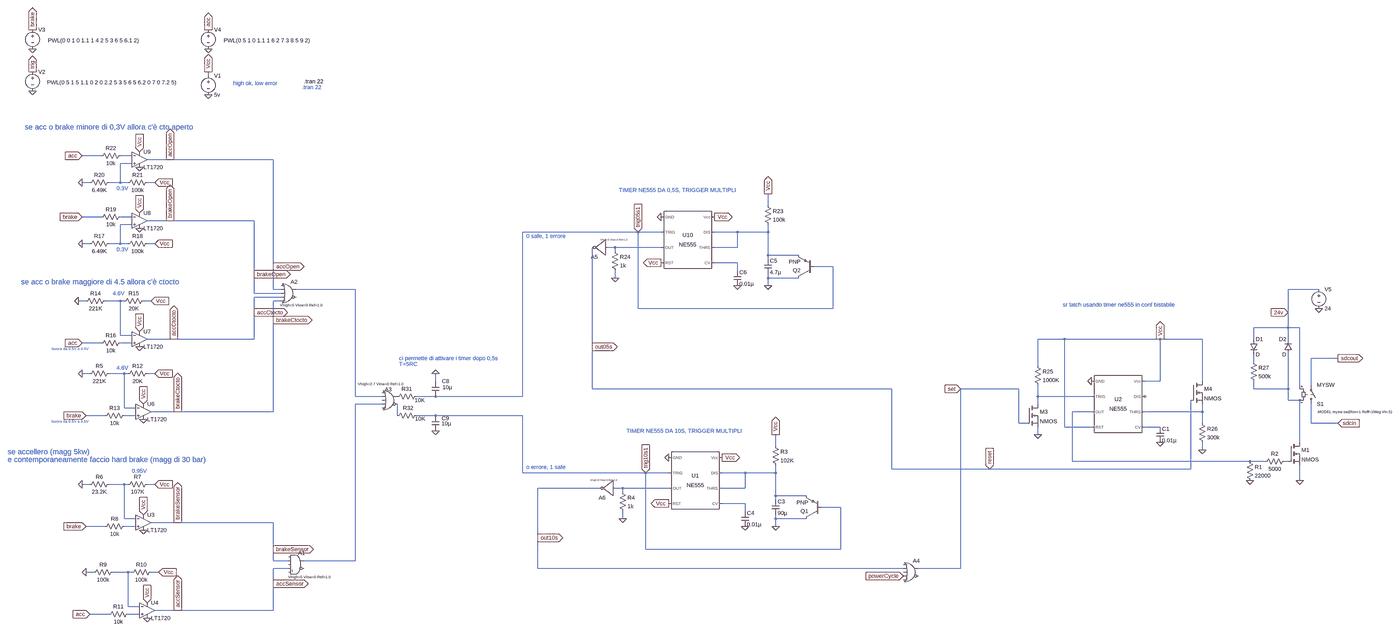
[diagram p0: schematic LTSpice_Bspd_NF.asc, whole sheet]
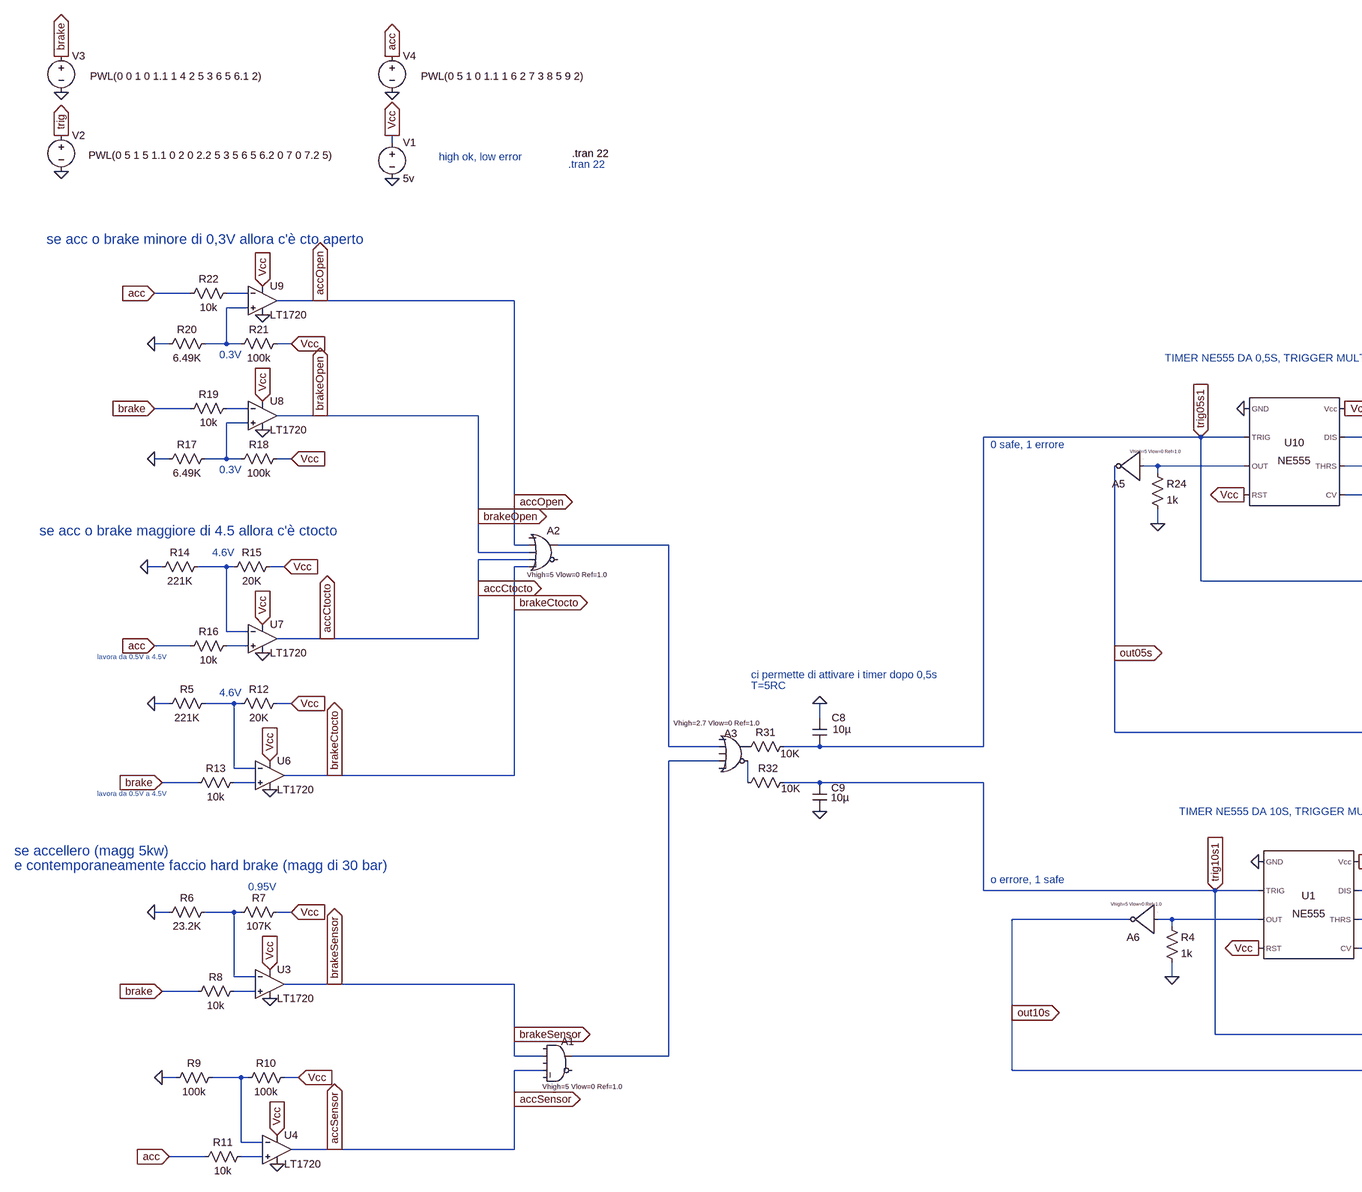
[diagram p1: schematic LTSpice_Bspd_NF.asc, part, row 1 of 1, column 1 of 2]
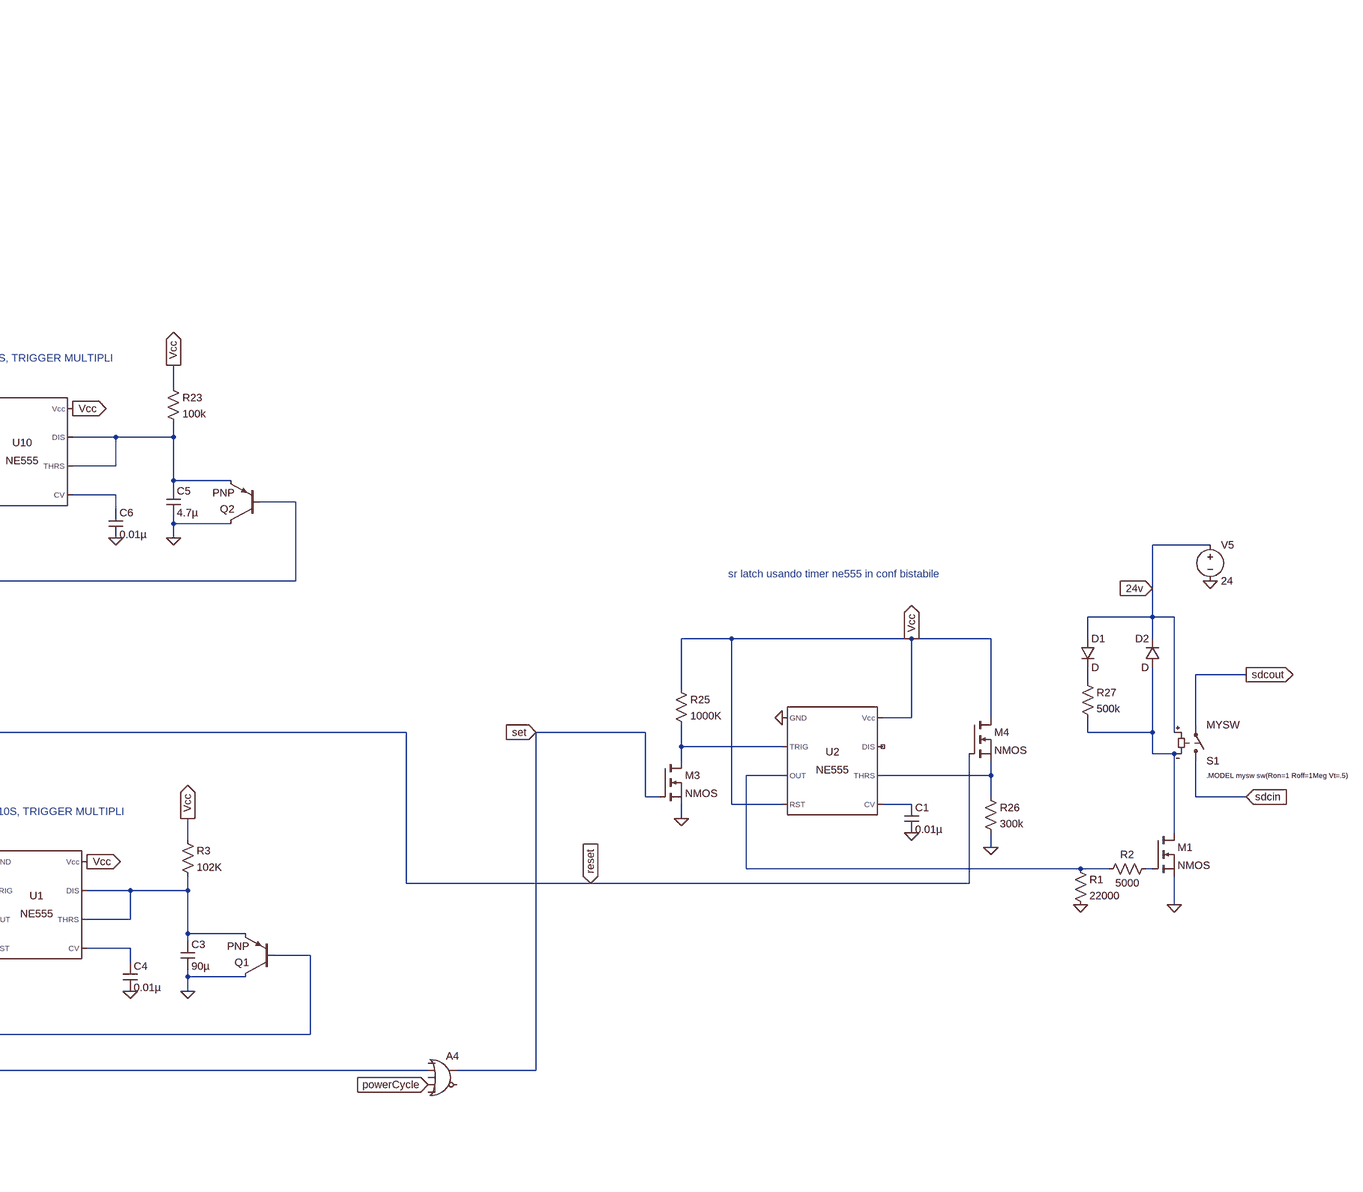
[diagram p2: schematic LTSpice_Bspd_NF.asc, part, row 1 of 1, column 2 of 2]
LTSpice_Bspd_NF.asc, the LTspice schematic file:
Version 4
SHEET 1 5304 2292
WIRE -1056 -720 -1056 -736
WIRE -1504 -368 -1584 -368
WIRE -1376 -368 -1424 -368
WIRE -1216 -352 -1312 -352
WIRE -784 -352 -1216 -352
WIRE -1376 -336 -1424 -336
WIRE -1552 -256 -1584 -256
WIRE -1424 -256 -1424 -336
WIRE -1424 -256 -1472 -256
WIRE -1392 -256 -1424 -256
WIRE -1280 -256 -1312 -256
WIRE 1408 -160 1408 -208
WIRE -1504 -112 -1584 -112
WIRE -1376 -112 -1424 -112
WIRE -1216 -96 -1312 -96
WIRE -864 -96 -1216 -96
WIRE -1376 -80 -1424 -80
WIRE 864 -48 352 -48
WIRE 960 -48 864 -48
WIRE 1280 -48 1184 -48
WIRE 1408 -48 1408 -80
WIRE 1408 -48 1280 -48
WIRE -1552 0 -1584 0
WIRE -1424 0 -1424 -80
WIRE -1424 0 -1472 0
WIRE -1392 0 -1424 0
WIRE -1280 0 -1312 0
WIRE 768 16 736 16
WIRE 960 16 768 16
WIRE 1280 16 1280 -48
WIRE 1280 16 1184 16
WIRE 768 32 768 16
WIRE 1408 48 1408 -48
WIRE 1536 48 1408 48
WIRE 1408 64 1408 48
WIRE 1280 80 1184 80
WIRE -784 96 -784 -352
WIRE 1680 96 1600 96
WIRE 1280 112 1280 80
WIRE -864 128 -864 -96
WIRE 768 144 768 112
WIRE 1408 144 1408 128
WIRE 1536 144 1408 144
WIRE 1408 176 1408 144
WIRE -784 192 -784 96
WIRE -752 192 -784 192
WIRE -368 192 -688 192
WIRE 4528 192 4400 192
WIRE -864 208 -864 128
WIRE -752 208 -864 208
WIRE -752 224 -864 224
WIRE -1568 240 -1600 240
WIRE -1424 240 -1488 240
WIRE -1408 240 -1424 240
WIRE -1296 240 -1328 240
WIRE -752 240 -784 240
WIRE 864 272 864 -48
WIRE 1680 272 1680 96
WIRE 1680 272 864 272
WIRE -864 288 -864 224
WIRE 4400 288 4400 192
WIRE -784 320 -784 240
WIRE 4400 352 4400 288
WIRE 4400 352 4256 352
WIRE 4448 352 4400 352
WIRE -1424 384 -1424 240
WIRE -1376 384 -1424 384
WIRE -1200 400 -1312 400
WIRE -864 400 -864 288
WIRE -864 400 -1200 400
WIRE 3376 400 3264 400
WIRE 3776 400 3376 400
WIRE 3952 400 3776 400
WIRE 4256 400 4256 352
WIRE 4400 400 4400 352
WIRE -1504 416 -1584 416
WIRE -1376 416 -1424 416
WIRE 672 432 672 16
WIRE 4608 480 4496 480
WIRE 4256 496 4256 464
WIRE 3264 512 3264 400
WIRE -1552 544 -1584 544
WIRE -1408 544 -1472 544
WIRE -1392 544 -1408 544
WIRE -1280 544 -1312 544
WIRE -32 576 -32 544
WIRE 3776 576 3776 400
WIRE 3776 576 3712 576
WIRE 3952 576 3952 400
WIRE 4496 592 4496 480
WIRE 672 608 672 432
WIRE 2016 608 672 608
WIRE 3184 608 2304 608
WIRE 4256 608 4256 576
WIRE 4400 608 4400 464
WIRE 4400 608 4256 608
WIRE 4448 608 4448 352
WIRE -368 640 -368 192
WIRE -256 640 -368 640
WIRE -32 640 -112 640
WIRE 352 640 352 -48
WIRE 352 640 -32 640
WIRE 3264 640 3264 592
WIRE 3488 640 3264 640
WIRE 4400 656 4400 608
WIRE 4448 656 4400 656
WIRE -256 672 -368 672
WIRE 3264 672 3264 640
WIRE -1408 688 -1408 544
WIRE -1360 688 -1408 688
WIRE -1184 704 -1296 704
WIRE -784 704 -784 320
WIRE -784 704 -1184 704
WIRE 3488 704 3408 704
WIRE 3952 704 3952 672
WIRE 3952 704 3712 704
WIRE -1488 720 -1568 720
WIRE -1360 720 -1408 720
WIRE -192 720 -192 672
WIRE -32 720 -112 720
WIRE 352 720 -32 720
WIRE 3184 752 3184 608
WIRE 3216 752 3184 752
WIRE 3952 752 3952 704
WIRE 4496 752 4496 672
WIRE 4608 752 4496 752
WIRE 3376 768 3376 400
WIRE 3488 768 3376 768
WIRE 3776 768 3712 768
WIRE 3264 800 3264 768
WIRE 4448 832 4448 656
WIRE 1440 848 1440 800
WIRE 3952 864 3952 832
WIRE 3408 912 3408 704
WIRE 4240 912 3408 912
WIRE 4304 912 4240 912
WIRE 4400 912 4384 912
WIRE 2016 944 2016 608
WIRE 2432 944 2016 944
WIRE 3904 944 3904 656
WIRE 3904 944 2432 944
WIRE 352 960 352 720
WIRE 896 960 352 960
WIRE 992 960 896 960
WIRE 1312 960 1216 960
WIRE 1440 960 1440 928
WIRE 1440 960 1312 960
WIRE 4448 992 4448 928
WIRE -1552 1008 -1584 1008
WIRE -1408 1008 -1472 1008
WIRE -1392 1008 -1408 1008
WIRE -1280 1008 -1312 1008
WIRE 704 1024 416 1024
WIRE 800 1024 768 1024
WIRE 992 1024 800 1024
WIRE 1312 1024 1312 960
WIRE 1312 1024 1216 1024
WIRE 800 1040 800 1024
WIRE 1440 1056 1440 960
WIRE 1568 1056 1440 1056
WIRE 1440 1072 1440 1056
WIRE 1312 1088 1216 1088
WIRE 1712 1104 1632 1104
WIRE 1312 1120 1312 1088
WIRE -1408 1152 -1408 1008
WIRE -1360 1152 -1408 1152
WIRE 800 1152 800 1120
WIRE 1440 1152 1440 1136
WIRE 1568 1152 1440 1152
WIRE -1184 1168 -1296 1168
WIRE -784 1168 -1184 1168
WIRE -1488 1184 -1568 1184
WIRE -1360 1184 -1408 1184
WIRE 1440 1184 1440 1152
WIRE 416 1232 416 1024
WIRE -784 1280 -784 1168
WIRE 896 1280 896 960
WIRE 1712 1280 1712 1104
WIRE 1712 1280 896 1280
WIRE -784 1328 -784 1280
WIRE -720 1328 -784 1328
WIRE -368 1328 -368 672
WIRE -368 1328 -656 1328
WIRE -720 1360 -784 1360
WIRE 416 1360 416 1232
WIRE 2064 1360 416 1360
WIRE 2304 1360 2304 608
WIRE 2304 1360 2128 1360
WIRE -1536 1376 -1568 1376
WIRE -1392 1376 -1456 1376
WIRE -1376 1376 -1392 1376
WIRE -1264 1376 -1296 1376
WIRE -784 1424 -784 1360
WIRE -1392 1520 -1392 1376
WIRE -1344 1520 -1392 1520
WIRE -1184 1536 -1280 1536
WIRE -784 1536 -784 1424
WIRE -784 1536 -1184 1536
WIRE -1472 1552 -1552 1552
WIRE -1344 1552 -1392 1552
FLAG -1056 -640 0
FLAG -1056 -736 Vcc
IOPIN -1056 -736 Out
FLAG -1792 -656 0
FLAG -1792 -736 trig
IOPIN -1792 -736 Out
FLAG 1440 1184 0
FLAG 1440 800 Vcc
IOPIN 1440 800 Out
FLAG 1312 1184 0
FLAG 800 1152 0
FLAG 1216 896 Vcc
IOPIN 1216 896 Out
FLAG 992 896 0
FLAG 992 1088 Vcc
IOPIN 992 1088 Out
FLAG 896 960 trig10s1
IOPIN 896 960 In
FLAG -1568 1184 brake
IOPIN -1568 1184 In
FLAG -1584 1008 0
FLAG -1280 1008 Vcc
IOPIN -1280 1008 In
FLAG -1792 -832 0
FLAG -1792 -912 brake
IOPIN -1792 -912 Out
FLAG -1328 1200 0
FLAG -1328 1136 Vcc
IOPIN -1328 1136 In
FLAG -1552 1552 acc
IOPIN -1552 1552 In
FLAG -1568 1376 0
FLAG -1264 1376 Vcc
IOPIN -1264 1376 In
FLAG -1312 1568 0
FLAG -1312 1504 Vcc
IOPIN -1312 1504 In
FLAG -1056 -832 0
FLAG -1056 -912 acc
IOPIN -1056 -912 Out
FLAG -1568 720 brake
IOPIN -1568 720 In
FLAG -1584 544 0
FLAG -1280 544 Vcc
IOPIN -1280 544 In
FLAG -1328 736 0
FLAG -1328 672 Vcc
IOPIN -1328 672 In
FLAG -1600 240 0
FLAG -1296 240 Vcc
IOPIN -1296 240 In
FLAG -1344 432 0
FLAG -1344 368 Vcc
IOPIN -1344 368 In
FLAG -1584 -368 acc
IOPIN -1584 -368 In
FLAG -1584 -256 0
FLAG -1280 -256 Vcc
IOPIN -1280 -256 In
FLAG -1344 -320 0
FLAG -1344 -384 Vcc
IOPIN -1344 -384 In
FLAG -1584 0 0
FLAG -1280 0 Vcc
IOPIN -1280 0 In
FLAG -1344 -64 0
FLAG -1344 -128 Vcc
IOPIN -1344 -128 In
FLAG -1584 -112 brake
IOPIN -1584 -112 In
FLAG -1216 -352 accOpen
IOPIN -1216 -352 Out
FLAG -1216 -96 brakeOpen
IOPIN -1216 -96 Out
FLAG -1200 400 accCtocto
IOPIN -1200 400 Out
FLAG -1584 416 acc
IOPIN -1584 416 In
FLAG -1184 704 brakeCtocto
IOPIN -1184 704 Out
FLAG -1184 1168 brakeSensor
IOPIN -1184 1168 Out
FLAG -1184 1536 accSensor
IOPIN -1184 1536 Out
FLAG 1408 176 0
FLAG 1408 -208 Vcc
IOPIN 1408 -208 Out
FLAG 1280 176 0
FLAG 768 144 0
FLAG 1184 -112 Vcc
IOPIN 1184 -112 Out
FLAG 960 -112 0
FLAG 960 80 Vcc
IOPIN 960 80 Out
FLAG 864 -48 trig05s1
IOPIN 864 -48 In
FLAG 2064 1392 powerCycle
IOPIN 2064 1392 In
FLAG 672 432 out05s
IOPIN 672 432 Out
FLAG -32 544 0
FLAG -32 784 0
FLAG 2432 944 reset
IOPIN 2432 944 In
FLAG 2304 608 set
IOPIN 2304 608 In
FLAG 3264 800 0
FLAG 3952 864 0
FLAG 3776 400 Vcc
IOPIN 3776 400 Out
FLAG 3488 576 0
FLAG 3776 832 0
FLAG 4240 992 0
FLAG 4448 992 0
FLAG 4400 288 24v
IOPIN 4400 288 In
FLAG 4608 480 sdcout
IOPIN 4608 480 Out
FLAG 4608 752 sdcin
IOPIN 4608 752 In
FLAG 4528 272 0
FLAG 416 1232 out10s
IOPIN 416 1232 Out
FLAG -784 96 accOpen
IOPIN -784 96 Out
FLAG -864 128 brakeOpen
IOPIN -864 128 Out
FLAG -864 288 accCtocto
IOPIN -864 288 Out
FLAG -784 320 brakeCtocto
IOPIN -784 320 Out
FLAG -784 1280 brakeSensor
IOPIN -784 1280 Out
FLAG -784 1424 accSensor
IOPIN -784 1424 Out
SYMBOL voltage -1056 -736 R0
WINDOW 123 0 0 Left 0
WINDOW 39 0 0 Left 0
SYMATTR InstName V1
SYMATTR Value 5v
SYMBOL voltage -1792 -752 R0
WINDOW 3 61 60 Left 2
WINDOW 123 0 0 Left 0
WINDOW 39 0 0 Left 0
SYMATTR Value PWL(0 5 1 5 1.1 0 2 0 2.2 5 3 5 6 5 6.2 0 7 0 7.2 5)
SYMATTR InstName V2
SYMBOL Misc\\NE555 1104 992 R0
SYMATTR InstName U1
SYMBOL res 1424 832 R0
SYMATTR InstName R3
SYMATTR Value 102K
SYMATTR SpiceLine tol=1 pwr=0.1
SYMBOL cap 1424 1072 R0
SYMATTR InstName C3
SYMATTR Value 90µ
SYMATTR SpiceLine V=50 Irms=4.899 Rser=0.025 Lser=0 mfg="Vishay" pn="T54E4906M050" type="Tantalum Polymer"
SYMBOL cap 1296 1120 R0
SYMATTR InstName C4
SYMATTR Value 0.01µ
SYMBOL res 784 1024 R0
SYMATTR InstName R4
SYMATTR Value 1k
SYMBOL pnp 1632 1152 R180
SYMATTR InstName Q1
SYMBOL Comparators\\LT1720 -1328 1104 R0
SYMATTR InstName U3
SYMBOL res -1456 992 R90
WINDOW 0 0 56 VBottom 2
WINDOW 3 32 56 VTop 2
SYMATTR InstName R6
SYMATTR Value 23.2K
SYMATTR SpiceLine tol=1 pwr=0.1
SYMBOL res -1296 992 R90
WINDOW 0 0 56 VBottom 2
WINDOW 3 32 56 VTop 2
SYMATTR InstName R7
SYMATTR Value 107K
SYMATTR SpiceLine tol=1 pwr=0.1
SYMBOL res -1392 1168 R90
WINDOW 0 0 56 VBottom 2
WINDOW 3 32 56 VTop 2
SYMATTR InstName R8
SYMATTR Value 10k
SYMBOL voltage -1792 -928 R0
WINDOW 3 64 61 Left 2
WINDOW 123 0 0 Left 0
WINDOW 39 0 0 Left 0
SYMATTR Value PWL(0 0 1 0 1.1 1 4 2 5 3 6 5 6.1 2)
SYMATTR InstName V3
SYMBOL Comparators\\LT1720 -1312 1472 R0
SYMATTR InstName U4
SYMBOL res -1440 1360 R90
WINDOW 0 0 56 VBottom 2
WINDOW 3 32 56 VTop 2
SYMATTR InstName R9
SYMATTR Value 100k
SYMBOL res -1280 1360 R90
WINDOW 0 0 56 VBottom 2
WINDOW 3 32 56 VTop 2
SYMATTR InstName R10
SYMATTR Value 100k
SYMBOL res -1376 1536 R90
WINDOW 0 0 56 VBottom 2
WINDOW 3 32 56 VTop 2
SYMATTR InstName R11
SYMATTR Value 10k
SYMBOL voltage -1056 -928 R0
WINDOW 3 64 61 Left 2
WINDOW 123 0 0 Left 0
WINDOW 39 0 0 Left 0
SYMATTR Value PWL(0 5 1 0 1.1 1 6 2 7 3 8 5 9 2)
SYMATTR InstName V4
SYMBOL Digital\\or -720 144 R0
WINDOW 39 -36 114 Left 1
SYMATTR SpiceLine Vhigh=5 Vlow=0 Ref=1.0
SYMATTR InstName A2
SYMBOL Comparators\\LT1720 -1328 640 R0
SYMATTR InstName U6
SYMBOL res -1456 528 R90
WINDOW 0 0 56 VBottom 2
WINDOW 3 32 56 VTop 2
SYMATTR InstName R5
SYMATTR Value 221K
SYMATTR SpiceLine tol=1 pwr=0.1
SYMBOL res -1296 528 R90
WINDOW 0 0 56 VBottom 2
WINDOW 3 32 56 VTop 2
SYMATTR InstName R12
SYMATTR Value 20K
SYMATTR SpiceLine tol=1 pwr=0.1
SYMBOL res -1392 704 R90
WINDOW 0 0 56 VBottom 2
WINDOW 3 32 56 VTop 2
SYMATTR InstName R13
SYMATTR Value 10k
SYMBOL Comparators\\LT1720 -1344 336 R0
SYMATTR InstName U7
SYMBOL res -1472 224 R90
WINDOW 0 0 56 VBottom 2
WINDOW 3 32 56 VTop 2
SYMATTR InstName R14
SYMATTR Value 221K
SYMATTR SpiceLine tol=1 pwr=0.1
SYMBOL res -1312 224 R90
WINDOW 0 0 56 VBottom 2
WINDOW 3 32 56 VTop 2
SYMATTR InstName R15
SYMATTR Value 20K
SYMATTR SpiceLine tol=1 pwr=0.1
SYMBOL res -1408 400 R90
WINDOW 0 0 56 VBottom 2
WINDOW 3 32 56 VTop 2
SYMATTR InstName R16
SYMATTR Value 10k
SYMBOL Comparators\\LT1720 -1344 -416 R0
SYMATTR InstName U9
SYMBOL res -1456 -272 R90
WINDOW 0 0 56 VBottom 2
WINDOW 3 32 56 VTop 2
SYMATTR InstName R20
SYMATTR Value 6.49K
SYMATTR SpiceLine tol=1 pwr=0.1
SYMBOL res -1296 -272 R90
WINDOW 0 0 56 VBottom 2
WINDOW 3 32 56 VTop 2
SYMATTR InstName R21
SYMATTR Value 100k
SYMBOL res -1408 -384 R90
WINDOW 0 0 56 VBottom 2
WINDOW 3 32 56 VTop 2
SYMATTR InstName R22
SYMATTR Value 10k
SYMBOL Comparators\\LT1720 -1344 -160 R0
SYMATTR InstName U8
SYMBOL res -1456 -16 R90
WINDOW 0 0 56 VBottom 2
WINDOW 3 32 56 VTop 2
SYMATTR InstName R17
SYMATTR Value 6.49K
SYMATTR SpiceLine tol=1 pwr=0.1
SYMBOL res -1296 -16 R90
WINDOW 0 0 56 VBottom 2
WINDOW 3 32 56 VTop 2
SYMATTR InstName R18
SYMATTR Value 100k
SYMBOL res -1408 -128 R90
WINDOW 0 0 56 VBottom 2
WINDOW 3 32 56 VTop 2
SYMATTR InstName R19
SYMATTR Value 10k
SYMBOL Digital\\or -224 592 R0
WINDOW 39 -133 -4 Left 1
WINDOW 0 -20 19 Left 2
SYMATTR SpiceLine Vhigh=2.7 Vlow=0 Ref=1.0
SYMATTR InstName A3
SYMBOL Digital\\and -688 1280 R0
WINDOW 39 -34 116 Left 1
SYMATTR SpiceLine Vhigh=5 Vlow=0 Ref=1.0
SYMATTR InstName A1
SYMBOL Misc\\NE555 1072 -16 R0
SYMATTR InstName U10
SYMBOL res 1392 -176 R0
SYMATTR InstName R23
SYMATTR Value 100k
SYMATTR SpiceLine tol=1 pwr=0.1
SYMBOL cap 1392 64 R0
SYMATTR InstName C5
SYMATTR Value 4.7µ
SYMATTR SpiceLine V=6.3 Irms=0 Rser=0 Lser=0 mfg="Murata" pn="GRM035R60J475ME15" type="X5R"
SYMBOL cap 1264 112 R0
SYMATTR InstName C6
SYMATTR Value 0.01µ
SYMBOL res 752 16 R0
SYMATTR InstName R24
SYMATTR Value 1k
SYMBOL pnp 1600 144 R180
SYMATTR InstName Q2
SYMBOL Digital\\or 2096 1312 R0
SYMATTR InstName A4
SYMBOL res -96 624 R90
WINDOW 0 0 56 VBottom 2
WINDOW 3 16 2 VTop 2
SYMATTR InstName R31
SYMATTR Value 10K
SYMATTR SpiceLine tol=1 pwr=0.1
SYMBOL cap -48 576 R0
WINDOW 0 43 0 Left 2
WINDOW 3 45 26 Left 2
SYMATTR InstName C8
SYMATTR Value 10µ
SYMATTR SpiceLine V=6.3 Irms=0 Rser=0 Lser=0
SYMBOL cap -48 720 R0
WINDOW 0 42 12 Left 2
WINDOW 3 41 33 Left 2
SYMATTR InstName C9
SYMATTR Value 10µ
SYMATTR SpiceLine V=6.3 Irms=0 Rser=0 Lser=0 mfg="Murata" pn="GRM155R60J106ME47" type="X5R"
SYMBOL res -96 704 R90
WINDOW 0 0 50 VBottom 2
WINDOW 3 14 0 VTop 2
SYMATTR InstName R32
SYMATTR Value 10K
SYMATTR SpiceLine tol=1 pwr=0.1
SYMBOL Digital\\inv 736 80 R180
WINDOW 39 -82 96 Left 0
SYMATTR SpiceLine Vhigh=5 Vlow=0 Ref=1.0
SYMATTR InstName A5
SYMBOL Digital\\inv 768 1088 R180
WINDOW 39 -8 97 Left 0
SYMATTR SpiceLine Vhigh=5 Vlow=0 Ref=1.0
SYMATTR InstName A6
SYMBOL res 3248 496 R0
SYMATTR InstName R25
SYMATTR Value 1000K
SYMATTR SpiceLine tol=1 pwr=0.1
SYMBOL nmos 3216 672 R0
SYMATTR InstName M3
SYMBOL nmos 3904 576 R0
SYMATTR InstName M4
SYMBOL res 3936 736 R0
SYMATTR InstName R26
SYMATTR Value 300k
SYMATTR SpiceLine tol=1 pwr=0.1
SYMBOL Misc\\NE555 3600 672 R0
SYMATTR InstName U2
SYMBOL cap 3760 768 R0
SYMATTR InstName C1
SYMATTR Value 0.01µ
SYMBOL res 4224 896 R0
SYMATTR InstName R1
SYMATTR Value 22000
SYMBOL res 4400 896 R90
WINDOW 0 0 56 VBottom 2
WINDOW 3 32 56 VTop 2
SYMATTR InstName R2
SYMATTR Value 5000
SYMBOL nmos 4400 832 R0
SYMATTR InstName M1
SYMBOL sw 4496 688 M180
SYMATTR InstName S1
SYMATTR Value MYSW
SYMBOL diode 4240 400 R0
SYMATTR InstName D1
SYMBOL diode 4416 464 R180
WINDOW 0 24 64 Left 2
WINDOW 3 24 0 Left 2
SYMATTR InstName D2
SYMBOL res 4240 480 R0
SYMATTR InstName R27
SYMATTR Value 500k
SYMBOL voltage 4528 176 R0
WINDOW 123 0 0 Left 0
WINDOW 39 0 0 Left 0
SYMATTR InstName V5
SYMATTR Value 24
TEXT -664 -672 Left 2 ;.tran 22
TEXT 816 784 Left 2 ;TIMER NE555 DA 10S, TRIGGER MULTIPLI
TEXT -952 -688 Left 2 ;high ok, low error
TEXT -1376 952 Left 2 ;0.95V
TEXT -1712 744 Left 1 ;lavora da 0.5V a 4.5V
TEXT -1712 440 Left 1 ;lavora da 0.5V a 4.5V
TEXT -1824 -488 Left 3 ;se acc o brake minore di 0,3V allora c'è cto aperto
TEXT -1440 -232 Left 2 ;0.3V
TEXT -1440 24 Left 2 ;0.3V
TEXT -1840 160 Left 3 ;se acc o brake maggiore di 4.5 allora c'è ctocto
TEXT -1896 872 Left 3 ;se accellero (magg 5kw)
TEXT -1456 208 Left 2 ;4.6V
TEXT -1440 520 Left 2 ;4.6V
TEXT -656 -696 Left 2 !.tran 22
TEXT 784 -224 Left 2 ;TIMER NE555 DA 0,5S, TRIGGER MULTIPLI
TEXT 3368 256 Left 2 ;sr latch usando timer ne555 in conf bistabile
TEXT -184 480 Left 2 ;ci permette di attivare i timer dopo 0,5s
TEXT -184 504 Left 2 ;T=5RC
TEXT 368 936 Left 2 ;o errore, 1 safe
TEXT 368 -32 Left 2 ;0 safe, 1 errore
TEXT 4520 704 Left 1 !.MODEL mysw sw(Ron=1 Roff=1Meg Vt=.5)
TEXT -1896 904 Left 3 ;e contemporaneamente faccio hard brake (magg di 30 bar)

The netlist it stands for:
* LTSpice_Bspd_NF.asc
V1 Vcc 0 5v
V2 trig 0 PWL(0 5 1 5 1.1 0 2 0 2.2 5 3 5 6 5 6.2 0 7 0 7.2 5)
XU1 0 trig10s1 N024 Vcc N025 N022 N022 Vcc NE555  ; pins GND TRIG OUT RST CV THRS DIS Vcc
R3 Vcc N022 102K tol=1 pwr=0.1
C3 N022 0 90µ V=50 Irms=4.899 Rser=0.025 Lser=0 mfg="Vishay" pn="T54E4906M050" type="Tantalum Polymer"
C4 N025 0 0.01µ
R4 N024 0 1k
Q1 0 trig10s1 N022 0 PNP
XU3 N026 N023 Vcc 0 brakeSensor LT1720  ; pins In+ In- V+ V- OUT
R6 N023 0 23.2K tol=1 pwr=0.1
R7 Vcc N023 107K tol=1 pwr=0.1
R8 N026 brake 10k
V3 brake 0 PWL(0 0 1 0 1.1 1 4 2 5 3 6 5 6.1 2)
XU4 N028 N027 Vcc 0 accSensor LT1720  ; pins In+ In- V+ V- OUT
R9 N027 0 100k
R10 Vcc N027 100k
R11 N028 acc 10k
V4 acc 0 PWL(0 5 1 0 1.1 1 6 2 7 3 8 5 9 2)
A2 0 accOpen brakeOpen accCtocto brakeCtocto 0 N008 0 OR Vhigh=5 Vlow=0 Ref=1.0
XU6 N018 N012 Vcc 0 brakeCtocto LT1720  ; pins In+ In- V+ V- OUT
R5 N012 0 221K tol=1 pwr=0.1
R12 Vcc N012 20K tol=1 pwr=0.1
R13 N018 brake 10k
XU7 N010 N009 Vcc 0 accCtocto LT1720  ; pins In+ In- V+ V- OUT
R14 N009 0 221K tol=1 pwr=0.1
R15 Vcc N009 20K tol=1 pwr=0.1
R16 N010 acc 10k
XU9 N002 N001 Vcc 0 accOpen LT1720  ; pins In+ In- V+ V- OUT
R20 N002 0 6.49K tol=1 pwr=0.1
R21 Vcc N002 100k
R22 N001 acc 10k
XU8 N004 N003 Vcc 0 brakeOpen LT1720  ; pins In+ In- V+ V- OUT
R17 N004 0 6.49K tol=1 pwr=0.1
R18 Vcc N004 100k
R19 N003 brake 10k
A3 0 N008 0 N015 0 N019 P001 0 OR Vhigh=2.7 Vlow=0 Ref=1.0
A1 0 brakeSensor 0 accSensor 0 0 N015 0 AND Vhigh=5 Vlow=0 Ref=1.0
XU10 0 trig05s1 N006 Vcc N007 N005 N005 Vcc NE555  ; pins GND TRIG OUT RST CV THRS DIS Vcc
R23 Vcc N005 100k tol=1 pwr=0.1
C5 N005 0 4.7µ V=6.3 Irms=0 Rser=0 Lser=0 mfg="Murata" pn="GRM035R60J475ME15" type="X5R"
C6 N007 0 0.01µ
R24 N006 0 1k
Q2 0 trig05s1 N005 0 PNP
A4 0 out10s 0 powerCycle 0 0 set 0 OR
R31 trig05s1 P001 10K tol=1 pwr=0.1
C8 0 trig05s1 10µ V=6.3 Irms=0 Rser=0 Lser=0
C9 trig10s1 0 10µ V=6.3 Irms=0 Rser=0 Lser=0 mfg="Murata" pn="GRM155R60J106ME47" type="X5R"
R32 trig10s1 N019 10K tol=1 pwr=0.1
A5 N006 0 0 0 0 reset 0 0 BUF Vhigh=5 Vlow=0 Ref=1.0
A6 N024 0 0 0 0 out10s 0 0 BUF Vhigh=5 Vlow=0 Ref=1.0
R25 Vcc N014 1000K tol=1 pwr=0.1
M3 N014 set 0 0 NMOS
M4 Vcc reset N017 N017 NMOS
R26 N017 0 300k tol=1 pwr=0.1
XU2 0 N014 N016 Vcc N020 N017 NC_01 Vcc NE555  ; pins GND TRIG OUT RST CV THRS DIS Vcc
C1 N020 0 0.01µ
R1 N016 0 22000
R2 N021 N016 5000
M1 N013 N021 0 0 NMOS
S1 sdcin sdcout 24v N013 MYSW
D1 24v N011 D
D2 N013 24v D
R27 N011 N013 500k
V5 24v 0 24
.model D D
.lib standard.dio
.model NPN NPN
.model PNP PNP
.lib standard.bjt
.model NMOS NMOS
.model PMOS PMOS
.lib standard.mos
* .tran 22
* TIMER NE555 DA 10S, TRIGGER MULTIPLI
* high ok, low error
* 0.95V
* lavora da 0.5V a 4.5V
* lavora da 0.5V a 4.5V
* se acc o brake minore di 0,3V allora c'è cto aperto
* 0.3V
* 0.3V
* se acc o brake maggiore di 4.5 allora c'è ctocto
* se accellero (magg 5kw)
* 4.6V
* 4.6V
.tran 22
* TIMER NE555 DA 0,5S, TRIGGER MULTIPLI
* sr latch usando timer ne555 in conf bistabile
* ci permette di attivare i timer dopo 0,5s
* T=5RC
* o errore, 1 safe
* 0 safe, 1 errore
.MODEL mysw sw(Ron=1 Roff=1Meg Vt=.5)
* e contemporaneamente faccio hard brake (magg di 30 bar)
.lib NE555.sub
.lib LT1720.sub
.backanno
.end